# Altium project mother1.PrjPCB
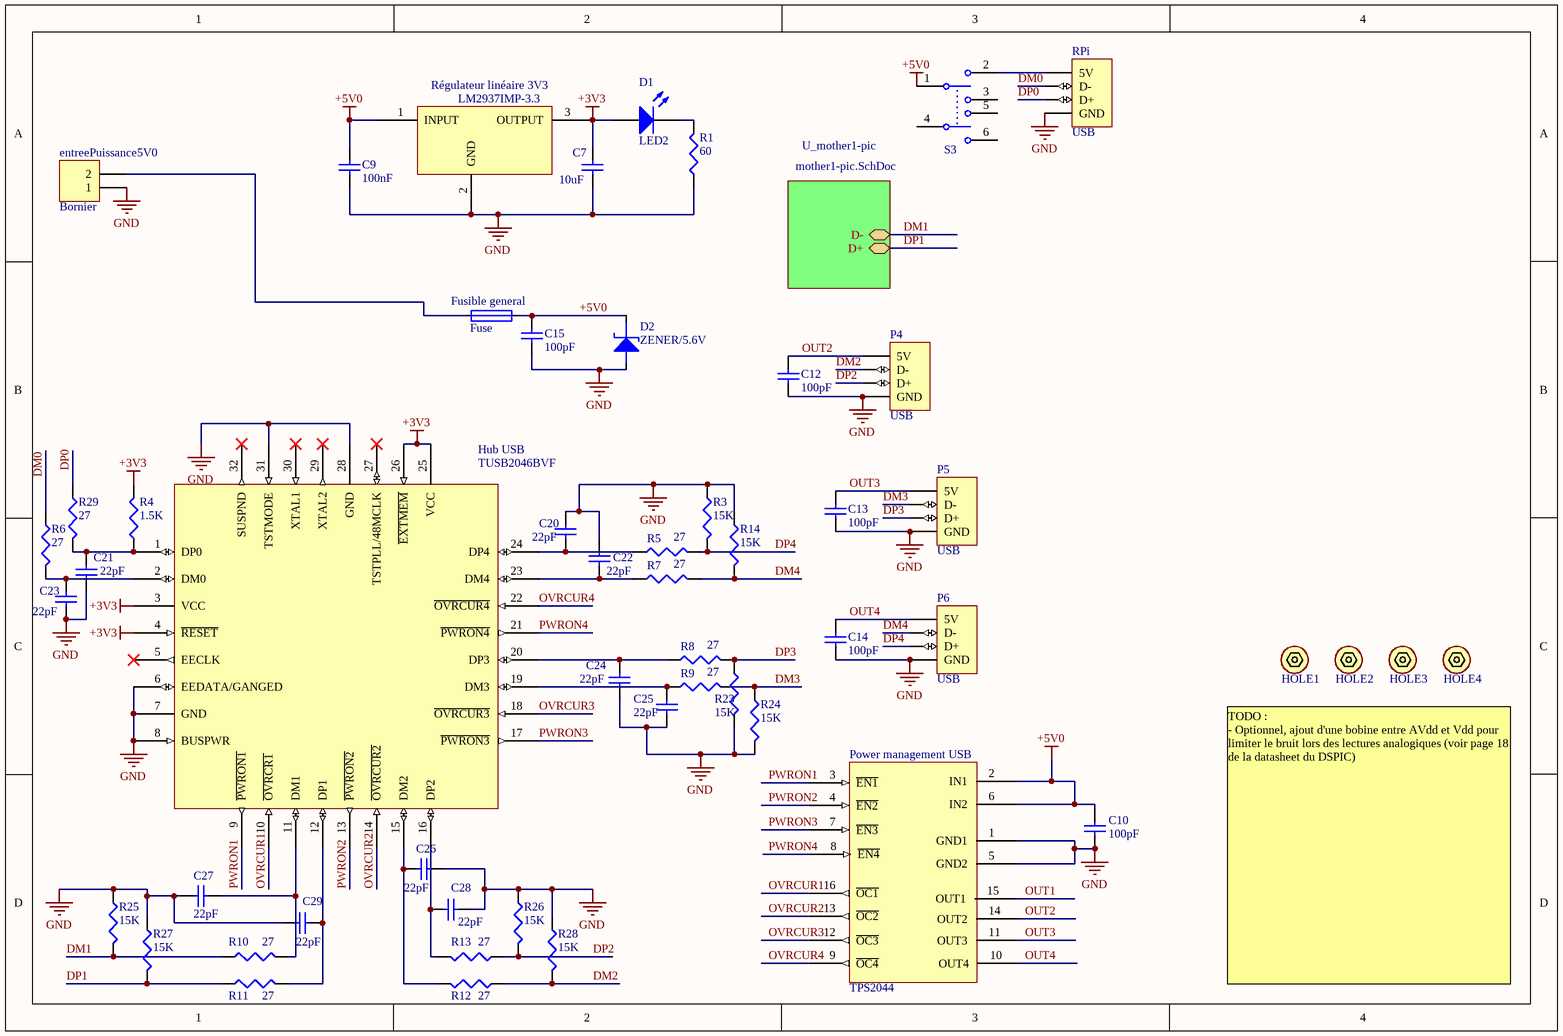
[diagram p0: mother1.SchDoc]
2 sheets, 88 parts. Net scope: hierarchical (ports join the sheet entries above them; power ports are global).
Board files: Mother.PcbDoc, Mother_2.PcbDoc
Sheets:
  mother1.SchDoc
    U_mother1-pic = mother1-pic.SchDoc

## Sheet mother1.SchDoc
size A4

### Parts
C7  value 10uF  [C0805C]  (hidden comment: CAP)
C9  value 100nF  [C0805C]  (hidden comment: CAP)
C10  value 100pF  [C0805C]  (hidden comment: CAP)
C12  value 100pF  [C0805C]  (hidden comment: CAP)
C13  value 100pF  [C0805C]  (hidden comment: CAP)
C14  value 100pF  [C0805C]  (hidden comment: CAP)
C15  value 100pF  [C0805C]  (hidden comment: CAP)
C20  value 22pF  [C0805C]  (hidden comment: CAP)
C21  value 22pF  [C0805C]  (hidden comment: CAP)
C22  value 22pF  [C0805C]  (hidden comment: CAP)
C23  value 22pF  [C0805C]  (hidden comment: CAP)
C24  value 22pF  [C0805C]  (hidden comment: CAP)
C25  value 22pF  [C0805C]  (hidden comment: CAP)
C26  value 22pF  [C0805C]  (hidden comment: CAP)
C27  value 22pF  [C0805C]  (hidden comment: CAP)
C28  value 22pF  [C0805C]  (hidden comment: CAP)
C29  value 22pF  [C0805C]  (hidden comment: CAP)
D1  LED2  [LED1206G]
D2  ZENER/5.6V  [DSO-C2/X1.8]
entreePuissance5V0  Bornier  [Bornier male coude 2 voies]
Fusible_general  Fuse  [Fuse Holder 5x20mm]
HOLE1  Hole  [SCREW]  (value not drawn)
HOLE2  Hole  [SCREW]  (value not drawn)
HOLE3  Hole  [SCREW]  (value not drawn)
HOLE4  Hole  [SCREW]  (value not drawn)
Hub_USB  TUSB2046BVF  [TUSB2046BVF]
P4  USB  [USB SM female vertical]
P5  USB  [USB SM female vertical]
P6  USB  [USB SM female vertical]
Power_management_USB  TPS2044  [TPS2044]
R1  value 60  [C0805R]  (hidden comment: RES)
R3  value 15K  [C0805R]  (hidden comment: RES)
R4  value 1.5K  [C0805R]  (hidden comment: RES)
R5  value 27  [C0805R]  (hidden comment: RES)
R6  value 27  [C0805R]  (hidden comment: RES)
R7  value 27  [C0805R]  (hidden comment: RES)
R8  value 27  [C0805R]  (hidden comment: RES)
R9  value 27  [C0805R]  (hidden comment: RES)
R10  value 27  [C0805R]  (hidden comment: RES)
R11  value 27  [C0805R]  (hidden comment: RES)
R12  value 27  [C0805R]  (hidden comment: RES)
R13  value 27  [C0805R]  (hidden comment: RES)
R14  value 15K  [C0805R]  (hidden comment: RES)
R23  value 15K  [C0805R]  (hidden comment: RES)
R24  value 15K  [C0805R]  (hidden comment: RES)
R25  value 15K  [C0805R]  (hidden comment: RES)
R26  value 15K  [C0805R]  (hidden comment: RES)
R27  value 15K  [C0805R]  (hidden comment: RES)
R28  value 15K  [C0805R]  (hidden comment: RES)
R29  value 27  [C0805R]  (hidden comment: RES)
RPi  USB  [USB SM2.5 Male]
Régulateur_linéaire_3V3  LM2937IMP-3.3  [SOT223]
S3  SW-DPDT/Reset  [MCLSS22]  (value not drawn)

### Sub-sheets
U_mother1-pic = mother1-pic.SchDoc: D- (bidir), D+ (bidir)

### Nets
+3V3: C7.2 D1.1(A) Hub_USB.3(VCC) Hub_USB.4(~{RESET}) Hub_USB.25(VCC) Hub_USB.26(~{EXTMEM}) R4.2 Régulateur_linéaire_3V3.3(OUTPUT)
+5V0: C9.1 C10.1 C15.2 D2.K Fusible_general.2 Power_management_USB.2(IN1) Power_management_USB.6(IN2) Régulateur_linéaire_3V3.1(INPUT) S3.1
GND: C7.1 C9.2 C10.2 C12.1 C13.1 C14.1 C15.1 C20.2 C21.2 C22.2 C23.2 C24.1 C25.1 C26.1 C27.2 C28.1 C29.1 D2.A entreePuissance5V0.1 Hub_USB.6(EEDATA/GANGED) Hub_USB.7(GND) Hub_USB.8(BUSPWR) Hub_USB.28(GND) Hub_USB.31(TSTMODE) P4.4(GND) P5.4(GND) P6.4(GND) Power_management_USB.1(GND1) Power_management_USB.5(GND2) R1.1 R3.1 R14.1 R23.2 R24.2 R25.1 R26.1 R27.1 R28.1 RPi.4(GND) Régulateur_linéaire_3V3.2(GND)
DM0: R6.1 RPi.2(D-)
DM1: R10.1 R25.2 ; sheet U_mother1-pic/D-  [project net D-]
DM2: P4.2(D-) R12.1 R28.2
DM3: P5.2(D-) R9.2 R24.1
DM4: P6.2(D-) R7.2 R14.2
DP0: R29.1 RPi.3(D+)
DP1: R11.1 R27.2 ; sheet U_mother1-pic/D+  [project net D+]
DP2: P4.3(D+) R13.1 R26.2
DP3: P5.3(D+) R8.2 R23.1
DP4: P6.3(D+) R3.2 R5.2
OUT1: Power_management_USB.15(OUT1)
OUT2: C12.2 P4.1(5V) Power_management_USB.14(OUT2)
OUT3: C13.2 P5.1(5V) Power_management_USB.11(OUT3)
OUT4: C14.2 P6.1(5V) Power_management_USB.10(OUT4)
OVRCUR1: Hub_USB.10(~{OVRCR1}) Power_management_USB.16(~{OC1})
OVRCUR2: Hub_USB.14(~{OVRCUR2}) Power_management_USB.13(~{OC2})
OVRCUR3: Hub_USB.18(~{OVRCUR3}) Power_management_USB.12(~{OC3})
OVRCUR4: Hub_USB.22(~{OVRCUR4}) Power_management_USB.9(~{OC4})
PWRON1: Hub_USB.9(~{PWRON1}) Power_management_USB.3(~{EN1})
PWRON2: Hub_USB.13(~{PWRON2}) Power_management_USB.4(~{EN2})
PWRON3: Hub_USB.17(~{PWRON3}) Power_management_USB.7(~{EN3})
PWRON4: Hub_USB.21(~{PWRON4}) Power_management_USB.8(~{EN4})
NetC20_1: C20.1 Hub_USB.24(DP4) R5.1
NetC21_1: C21.1 Hub_USB.1(DP0) R4.1 R29.2
NetC22_1: C22.1 Hub_USB.23(DM4) R7.1
NetC23_1: C23.1 Hub_USB.2(DM0) R6.2
NetC24_2: C24.2 Hub_USB.20(DP3) R8.1
NetC25_2: C25.2 Hub_USB.19(DM3) R9.1
NetC26_2: C26.2 Hub_USB.15(DM2) R12.2
NetC27_1: C27.1 Hub_USB.11(DM1) R10.2
NetC28_2: C28.2 Hub_USB.16(DP2) R13.2
NetC29_2: C29.2 Hub_USB.12(DP1) R11.2
NetD1_2: D1.2(K) R1.2
NetentreePuissance5V0_2: entreePuissance5V0.2 Fusible_general.1
NetRPi_1: RPi.1(5V) S3.2

Not connected (* = marked no-connect by the designer): HOLE1 1(Hole); HOLE2 1(Hole); HOLE3 1(Hole); HOLE4 1(Hole); Hub_USB 5(EECLK)* 27(TSTPLL/48MCLK)* 29(XTAL2)* 30(XTAL1)* 32(SUSPND)*; S3 3 4 5 6

### Notes on the sheet
- TODO :
  - Optionnel, ajout d'une bobine entre AVdd et Vdd pour limiter le bruit lors des lectures analogiques (voir page 18 de la datasheet du DSPIC)

### Library data of the parts
C7 C9 C10 C12-C15 C20-C29 = CAP: Capacitor; Published: 8-Jun-2000; LatestRevisionDate: 29-May-2009; LatestRevisionNote: IPC-7351 Footprint Added.; PackageReference: C1206; Publisher: Altium Limited; PackageDescription: Chip Capacitor
D1 = LED2: Typical RED, GREEN, YELLOW, AMBER GaAs LED; Published: 8-Jun-2000; LatestRevisionDate: 17-Jul-2002; LatestRevisionNote: Re-released for DXP Platform.; PackageVersion: Feb-2002; PackageReference: 3.2X1.6X1.1; Publisher: Altium Limited; PackageDescription: SM LED; 2 Flat Leads
D2 = ZENER
entreePuissance5V0 = Header 2: Header, 2-Pin; LatestRevisionDate: 17-Jul-2002; LatestRevisionNote: Re-released for DXP Platform.; Publisher: Altium Limited
HOLE1-HOLE4 = Hole: Mounting Hole for screws
Hub_USB = TUSB2046BVF: TI 4-Port USB Hub
P4-P6 RPi = USB Con: USB Connector; LatestRevisionDate: 17-Jul-2002; LatestRevisionNote: Re-released for DXP Platform.; Publisher: Altium Limited
Power_management_USB = TPS2044: Power distribution USB
R1 R3-R14 R23-R29 = RES: Resistor; Published: 8-Jun-2000; LatestRevisionDate: 29-May-2009; LatestRevisionNote: IPC-7351 Footprint Added.; PackageReference: J1-0603; Publisher: Altium Limited; PackageDescription: Chip Resistor
Régulateur_linéaire_3V3 = LM2937IMP-3.3: 500 mA Low Dropout Regulator
S3 = SW-DPDT: Double-Pole, Double-Throw Switch, ref MCLSS22; Published: 24-Mar-1999; LatestRevisionDate: 17-Jul-2002; LatestRevisionNote: Re-released for DXP Platform.; PackageReference: DPDT-6; Publisher: Altium Limited; PackageDescription: Switch; 6 Leads

## Sheet mother1-pic.SchDoc
size A4
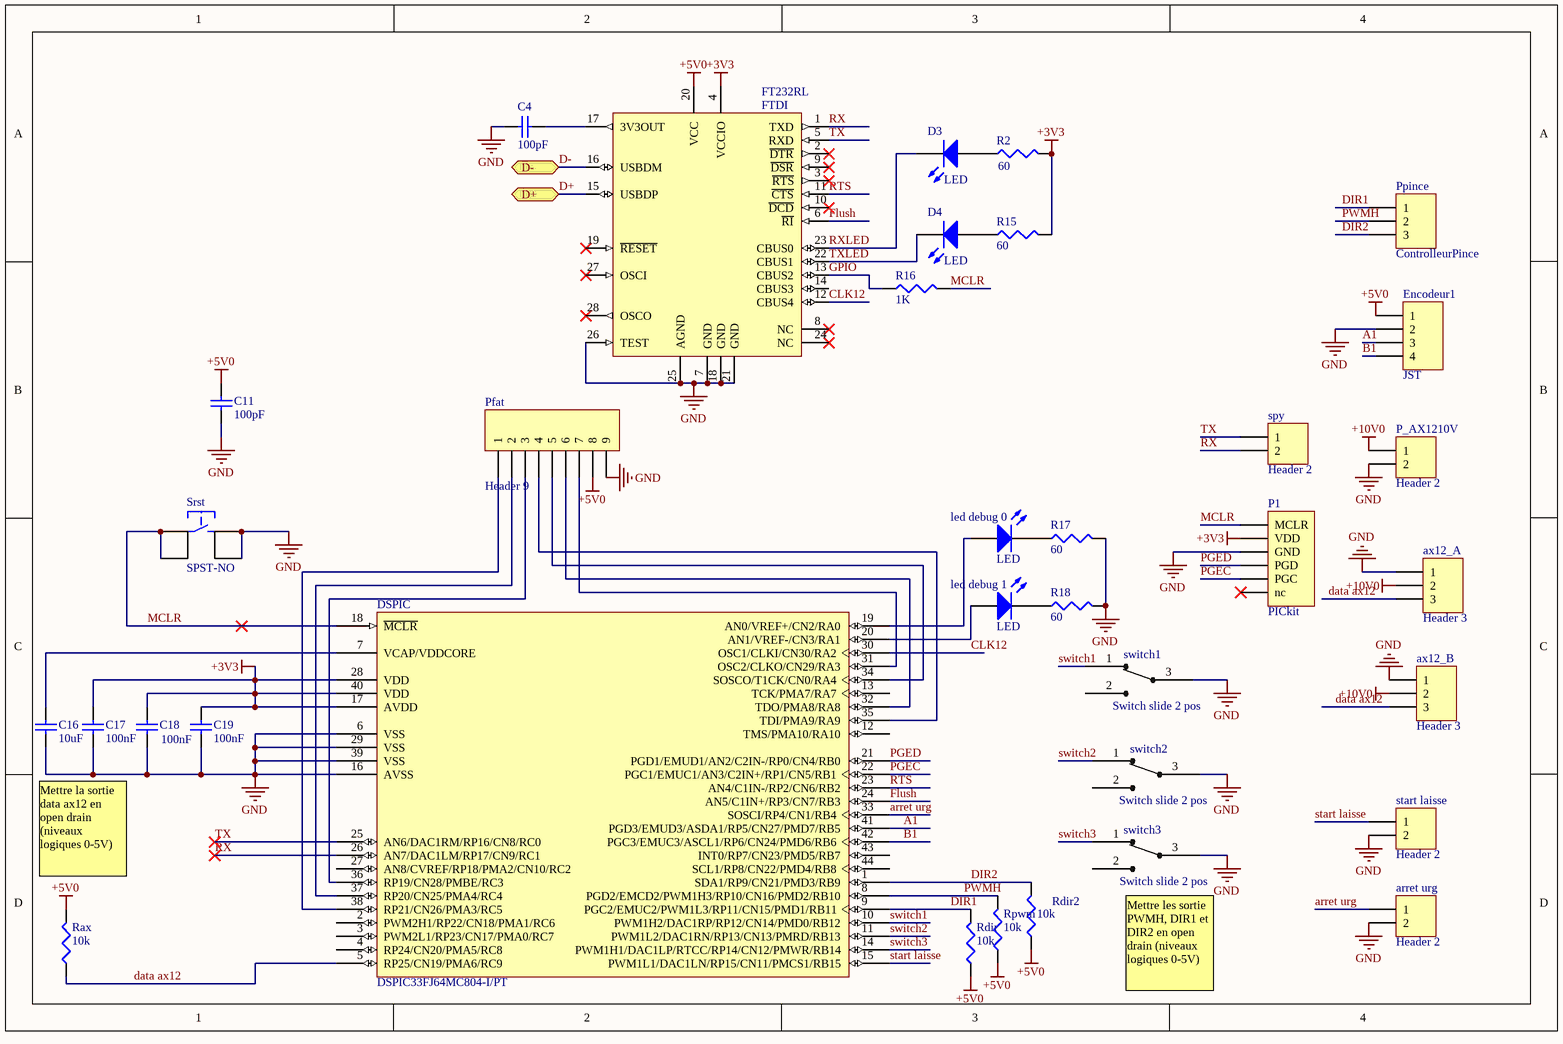
[diagram p1: mother1-pic.SchDoc]

### Parts
arret_urg  Header 2  [HDR1X2]
ax12_A  Header 3  [HDR1X3]
ax12_B  Header 3  [HDR1X3]
C4  value 100pF  [C0805C]  (hidden comment: CAP)
C11  value 100pF  [C0805C]  (hidden comment: CAP)
C16  value 10uF  [C0805C]  (hidden comment: CAP)
C17  value 100nF  [C0805C]  (hidden comment: CAP)
C18  value 100nF  [C0805C]  (hidden comment: CAP)
C19  value 100nF  [C0805C]  (hidden comment: CAP)
D3  LED  [LED1206Y]
D4  LED  [LED1206Y]
DSPIC  DSPIC33FJ64MC804-I/PT  [TQFP-PT44_N]
Encodeur1  JST  [B4B-PH-K-S]
FTDI  FT232RL  [SSOP-28_M]
led_debug_0  LED  [LED1206R]
led_debug_1  LED  [LED1206R]
P1  PICkit  [HDR1X6H]
P_AX1210V  Header 2  [Bornier male coude 2 voies]
Pfat  Header 9  [HDR1X9]
Ppince  ControlleurPince  [HDR1X3]
R2  value 60  [C0805R]  (hidden comment: RES)
R15  value 60  [C0805R]  (hidden comment: RES)
R16  value 1K  [C0805R]  (hidden comment: RES)
R17  value 60  [C0805R]  (hidden comment: RES)
R18  value 60  [C0805R]  (hidden comment: RES)
Rax  value 10k  [C0805R]  (hidden comment: RES)
Rdir  value 10k  [C0805R]  (hidden comment: RES)
Rdir2  value 10k  [C0805R]  (hidden comment: RES)
Rpwm  value 10k  [C0805R]  (hidden comment: RES)
spy  Header 2  [HDR1X2]
Srst  SPST-NO  [SPST-NO]
start_laisse  Header 2  [HDR1X2]
switch1  Switch slide 2 pos  [Switch sur cosses 5.08mm]
switch2  Switch slide 2 pos  [Switch sur cosses 5.08mm]
switch3  Switch slide 2 pos  [Switch sur cosses 5.08mm]

### Ports
D+ (bidir), D- (bidir)

### Nets
+3V3: C17.2 C18.2 C19.2 DSPIC.17(AVDD) DSPIC.28(VDD) DSPIC.40(VDD) FTDI.4(VCCIO) P1.2(VDD) R2.2 R15.2
+5V0: C11.2 Encodeur1.1 FTDI.20(VCC) Pfat.8 Rax.2 Rdir.1 Rdir2.1 Rpwm.1
+10V0: ax12_A.2 ax12_B.2 P_AX1210V.1
GND: arret_urg.2 ax12_A.1 ax12_B.1 C4.2 C11.1 C16.1 C17.1 C18.1 C19.1 DSPIC.6(VSS) DSPIC.16(AVSS) DSPIC.29(VSS) DSPIC.39(VSS) Encodeur1.2 FTDI.7(GND) FTDI.18(GND) FTDI.21(GND) FTDI.25(AGND) FTDI.26(TEST) P1.3(GND) P_AX1210V.2 Pfat.9 R17.2 R18.2 Srst.3 Srst.4 start_laisse.2 switch1.3 switch2.3 switch3.3
A1: DSPIC.41(PGD3/EMUD3/ASDA1/RP5/CN27/PMD7/RB5) Encodeur1.3
arret urg: arret_urg.1 DSPIC.33(SOSCI/RP4/CN1/RB4)
B1: DSPIC.42(PGC3/EMUC3/ASCL1/RP6/CN24/PMD6/RB6) Encodeur1.4
CLK12: DSPIC.30(OSC1/CLKI/CN30/RA2) FTDI.12(CBUS4)
D+: FTDI.15(USBDP) ; port D+
D-: FTDI.16(USBDM) ; port D-
data ax12: ax12_A.3 ax12_B.3 DSPIC.5(RP25/CN19/PMA6/RC9) Rax.1
DIR1: DSPIC.9(PGC2/EMUC2/PWM1L3/RP11/CN15/PMD1/RB11) Ppince.1 Rdir.2
DIR2: DSPIC.1(SDA1/RP9/CN21/PMD3/RB9) Ppince.3 Rdir2.2
Flush: DSPIC.24(AN5/C1IN+/RP3/CN7/RB3) FTDI.6(~{RI})
GPIO: FTDI.13(CBUS2) R16.1
MCLR: DSPIC.18(~{MCLR}) P1.1(MCLR) R16.2 Srst.1 Srst.2
PGEC: DSPIC.22(PGC1/EMUC1/AN3/C2IN+/RP1/CN5/RB1) P1.5(PGC)
PGED: DSPIC.21(PGD1/EMUD1/AN2/C2IN-/RP0/CN4/RB0) P1.4(PGD)
PWMH: DSPIC.8(PGD2/EMCD2/PWM1H3/RP10/CN16/PMD2/RB10) Ppince.2 Rpwm.2
RTS: DSPIC.23(AN4/C1IN-/RP2/CN6/RB2) FTDI.11(~{CTS})
RX: DSPIC.26(AN7/DAC1LM/RP17/CN9/RC1) FTDI.1(TXD) spy.2
RXLED: D3.2(K) FTDI.23(CBUS0)
start laisse: DSPIC.15(PWM1L1/DAC1LN/RP15/CN11/PMCS1/RB15) start_laisse.1
switch1: DSPIC.10(PWM1H2/DAC1RP/RP12/CN14/PMD0/RB12) switch1.1
switch2: DSPIC.11(PWM1L2/DAC1RN/RP13/CN13/PMRD/RB13) switch2.1
switch3: DSPIC.14(PWM1H1/DAC1LP/RTCC/RP14/CN12/PMWR/RB14) switch3.1
TX: DSPIC.25(AN6/DAC1RM/RP16/CN8/RC0) FTDI.5(RXD) spy.1
TXLED: D4.2(K) FTDI.22(CBUS1)
NetC4_1: C4.1 FTDI.17(3V3OUT)
NetC16_2: C16.2 DSPIC.7(VCAP/VDDCORE)
NetD3_1: D3.1(A) R2.1
NetD4_1: D4.1(A) R15.1
NetDSPIC_19: DSPIC.19(AN0/VREF+/CN2/RA0) led_debug_0.1(A)
NetDSPIC_20: DSPIC.20(AN1/VREF-/CN3/RA1) led_debug_1.1(A)
NetDSPIC_31: DSPIC.31(OSC2/CLKO/CN29/RA3) Pfat.7
NetDSPIC_32: DSPIC.32(TDO/PMA8/RA8) Pfat.6
NetDSPIC_34: DSPIC.34(SOSCO/T1CK/CN0/RA4) Pfat.5
NetDSPIC_35: DSPIC.35(TDI/PMA9/RA9) Pfat.4
NetDSPIC_36: DSPIC.36(RP19/CN28/PMBE/RC3) Pfat.3
NetDSPIC_37: DSPIC.37(RP20/CN25/PMA4/RC4) Pfat.2
NetDSPIC_38: DSPIC.38(RP21/CN26/PMA3/RC5) Pfat.1
Netled_debug_0_2: led_debug_0.2(K) R17.1
Netled_debug_1_2: led_debug_1.2(K) R18.1

Not connected (* = marked no-connect by the designer): DSPIC 2(PWM2H1/RP22/CN18/PMA1/RC6) 3(PWM2L1/RP23/CN17/PMA0/RC7) 4(RP24/CN20/PMA5/RC8) 12(TMS/PMA10/RA10) 13(TCK/PMA7/RA7) 27(AN8/CVREF/RP18/PMA2/CN10/RC2) 43(INT0/RP7/CN23/PMD5/RB7) 44(SCL1/RP8/CN22/PMD4/RB8); FTDI 2(~{DTR})* 3(~{RTS})* 8(NC)* 9(~{DSR})* 10(~{DCD})* 14(CBUS3) 19(~{RESET})* 24(NC)* 27(OSCI)* 28(OSCO)*; P1 6(nc)*; switch1 2; switch2 2; switch3 2

### Notes on the sheet
- Mettre la sortie data ax12 en open drain (niveaux logiques 0-5V)
- (near switch3) Mettre les sortie PWMH, DIR1 et DIR2 en open drain (niveaux logiques 0-5V)

### Library data of the parts
arret_urg P_AX1210V spy start_laisse = Header 2: Header, 2-Pin; LatestRevisionDate: 17-Jul-2002; LatestRevisionNote: Re-released for DXP Platform.; Publisher: Altium Limited
ax12_A ax12_B Ppince = Header 3: Header, 3-Pin; LatestRevisionDate: 17-Jul-2002; LatestRevisionNote: Re-released for DXP Platform.; Publisher: Altium Limited
C4 C11 C16-C19 = CAP: Capacitor; Published: 8-Jun-2000; LatestRevisionDate: 29-May-2009; LatestRevisionNote: IPC-7351 Footprint Added.; PackageReference: C1206; Publisher: Altium Limited; PackageDescription: Chip Capacitor
D3 D4 led_debug_0 led_debug_1 = LED2: as D1 on sheet mother1; Published: 8-Jun-2000; LatestRevisionDate: 17-Jul-2002; LatestRevisionNote: Re-released for DXP Platform.; PackageVersion: Feb-2002; PackageReference: 3.2X1.6X1.1; Publisher: Altium Limited; PackageDescription: SM LED; 2 Flat Leads
DSPIC = DSPIC33FJ64MC804-I/PT: High-Performance 16-bit Digital Signal Controller, 64 KB Flash, 16 KB RAM, 44-Pin TQFP, Industrial Temperature; Published: 2-Dec-2009; DatasheetVersion: revD, Nov-2009; PackageVersion: revBB, Aug-2009; PackageReference: TQFP-PT44; Publisher: Altium Limited; PackageDescription: 44-Lead Plastic Thin Quad Flatpack (PT) - 10x10x1mm Body, 2.00mm [TQFP]; Supplier 1: Digi-Key; Supplier Part Number 1: DSPIC33FJ64MC804-I/PT-ND; Supplier 2: Farnell; Supplier Part Number 2: 1576844; Code_JEDEC: MS-026; ComponentLink1Description: Datasheet; ComponentLink1URL: http://ww1.microchip.com/downloads/en/DeviceDoc/70291D.pdf; ComponentLink2Description: Packaging Specification; ComponentLink2URL: http://www.microchip.com/stellent/groups/techpub_sg/documents/packagingspec/en012702.pdf; ComponentLink3Description: Microchip.com Home; ComponentLink3URL: http://www.microchip.com/
Encodeur1 = Header 4: Header, 4-Pin; LatestRevisionDate: 17-Jul-2002; LatestRevisionNote: Re-released for DXP Platform.; Publisher: Altium Limited
FTDI = FT232RL: USB UART Asynchronous Serial Data Transfer Chip, SSOP-28, Tube; Published: 19-Aug-2010; DatasheetVersion: ver 2.07, Jul-2010; PackageVersion: 2010; PackageReference: SSOP-28; Publisher: Altium Limited; PackageDescription: 28-Pin Small Outline Package 0.65 mm Pitch; ComponentLink1Description: Manufacturer Link; ComponentLink1URL: http://www.ftdichip.com/Products/ICs/FT232R.htm; ComponentLink2Description: Datasheet; ComponentLink2URL: http://www.ftdichip.com/Support/Documents/DataSheets/ICs/DS_FT232R.pdf
P1 = Header ICSP: Header, 6-Pin, Right Angle; LatestRevisionDate: 17-Jul-2002; LatestRevisionNote: Re-released for DXP Platform.; Publisher: Altium Limited
Pfat = Header 9: Header, 9-Pin; LatestRevisionDate: 17-Jul-2002; LatestRevisionNote: Re-released for DXP Platform.; Publisher: Altium Limited
R2 R15-R18 Rax Rdir Rdir2 Rpwm = RES: Resistor; Published: 8-Jun-2000; LatestRevisionDate: 29-May-2009; LatestRevisionNote: IPC-7351 Footprint Added.; PackageReference: J1-0603; Publisher: Altium Limited; PackageDescription: Chip Resistor
Srst = SPST-NO: Tactile Switch 7.3mm, SMD
switch1-switch3 = Switch slide On/Off: Switch slide 2 positions

## Nets that join several sheets
+3V3: mother1 (8 pins), mother1-pic (10 pins)
+5V0: mother1 (9 pins), mother1-pic (8 pins)
GND: mother1 (40 pins), mother1-pic (30 pins)
D+: mother1 (R11.1 R27.2), mother1-pic (FTDI.15)
D-: mother1 (R10.1 R25.2), mother1-pic (FTDI.16)